# Altium schematic sheet Hbrygga.SchDoc
size A; SheetNumber: 1; SheetTotal: 2
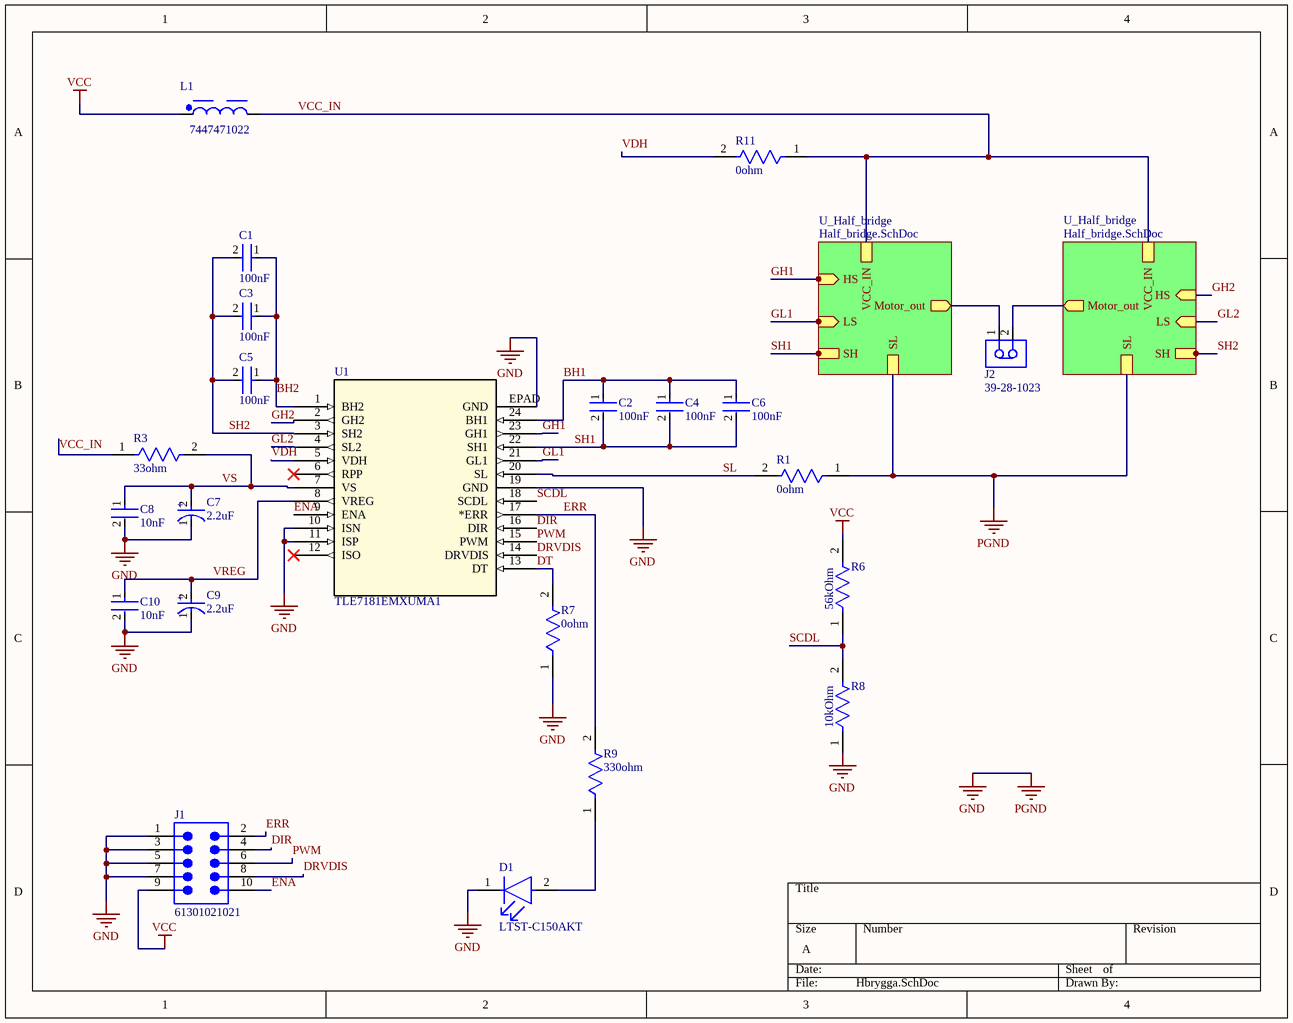
[diagram p0: Hbrygga.SchDoc]

## Parts
C1  100nF  [FP-C1206C-EB-MFG]
C2  100nF  [FP-C1206C-EB-MFG]
C3  100nF  [FP-C1206C-EB-MFG]
C4  100nF  [FP-C1206C-EB-MFG]
C5  100nF  [FP-C1206C-EB-MFG]
C6  100nF  [FP-C1206C-EB-MFG]
C7  2.2uF  [FP-RAD-TH-D_5_0_5-L_11_1-MFG]
C8  10nF  [FP-C0805C-DN-MFG]
C9  2.2uF  [FP-RAD-TH-D_5_0_5-L_11_1-MFG]
C10  10nF  [FP-C0805C-DN-MFG]
D1  LTST-C150AKT  [FP-LTST-C150AKT-MFG]
J1  61301021021  [61301021021]
J2  39-28-1023  [MOLX-39-28-1023-2_V]
L1  7447471022  [WE-TIS_1111]
R1  0ohm  [FP-RC3216-IPC_C]
R3  33ohm  [FP-CR1206-IPC_B]
R6  56kOhm  [FP-MCR10-IPC_C]
R7  0ohm  [FP-RC3216-IPC_C]
R8  10kOhm  [FP-MCR10-IPC_C]
R9  330ohm  [FP-RK73G2B-MFG]
R11  0ohm  [FP-RC3216-IPC_C]
U1  TLE7181EMXUMA1  [PG-SSOP-4_INF]

## Sub-sheets
U_Half_bridge = Half_bridge.SchDoc: HS (in), LS (in), Motor_out (out), VCC_IN, SL, SH
U_Half_bridge = Half_bridge.SchDoc: HS (in), LS (in), Motor_out (out), VCC_IN, SL, SH

## Nets
GND: C7.1(C) C8.2 C9.1(C) C10.2 D1.1(C) J1.1 J1.3 J1.5 J1.7 R1.1 R7.1 R8.1 U1.10(ISN) U1.11(ISP) U1.19(GND) U1.EPAD(GND) ; sheet U_Half_bridge/SL, sheet U_Half_bridge/SL  [also labelled PGND]
VCC: J1.9 L1.1 R6.2
BH1: C2.1 C4.1 C6.1 U1.24(BH1)
BH2: C1.1 C3.1 C5.1 U1.1(BH2)
DIR: J1.4 U1.16(DIR)
DRVDIS: J1.8 U1.14(DRVDIS)
DT: R7.2 U1.13(DT)
ENA: J1.10 U1.9(ENA)
ERR: J1.2 R9.2 U1.17(*ERR)
GH1: U1.23(GH1) ; sheet U_Half_bridge/HS
GH2: U1.2(GH2) ; sheet U_Half_bridge/HS
GL1: U1.21(GL1) ; sheet U_Half_bridge/LS
GL2: U1.4(SL2) ; sheet U_Half_bridge/LS
PWM: J1.6 U1.15(PWM)
SCDL: R6.1 R8.2 U1.18(SCDL)
SH1: C2.2 C4.2 C6.2 U1.22(SH1) ; sheet U_Half_bridge/SH
SH2: C1.2 C3.2 C5.2 U1.3(SH2) ; sheet U_Half_bridge/SH
SL: R1.2 U1.20(SL)
VCC_IN: L1.2 R3.1 R11.1 ; sheet U_Half_bridge/VCC_IN, sheet U_Half_bridge/VCC_IN
VDH: R11.2 U1.5(VDH)
VREG: C9.2(A) C10.1 U1.8(VREG)
VS: C7.2(A) C8.1 R3.2 U1.7(VS)
NetD1_2: D1.2(A) R9.1
NetJ2_1: J2.1 ; sheet U_Half_bridge/Motor_out
NetJ2_2: J2.2 ; sheet U_Half_bridge/Motor_out

Not connected (* = marked no-connect by the designer): U1 6(RPP)* 12(ISO)*

## Notes on the sheet
- (in symbol CMP-05427-000193-1) +

## Library data of the parts
C1-C6 = CMP-03020-008411-1: C1206 0.10 μF U2J 2.00% 16 V; Manufacturer Part Number: C1206C104G4JACAUTO; Manufacturer: KEMET; Material: Ceramic; Temperature Coefficient: 15%; Tolerance: 0.02; Value: 0.10 μF; Automotive Grade: Grade 0; Voltage Rating: 16 V; Lead Free: Yes; RoHS: TRUE; Device Class L3: Ceramic Capacitors; Height: 0.88mm; ComponentLink2Description: Datasheet; Device Class L1: Passive Components; Package: C1206C-EB; Ipc Land Pattern Name: CAPC320160X78; Automotive: Yes; Category: Cap; Octopart: https://octopart.com/c1206c104g4jacauto-kemet-84732513; Temperature Range High: +150°C; Temperature: -55°C to +150°C; ComponentLink2URL: https://content.kemet.com/datasheets/KEM_C1007_X8R_ULTRA_150C_SMD.pdf; Device Class L2: Capacitors; Temperature Characteristic: U2J; Temperature Range Low: -55°C; Capacitance: 0.10 μF
C7 C9 = CMP-05427-000193-1: Aluminum Electrolytic Capacitors (Radial Lead Type) 2.2uF ±20% 100V; Life (Hours): 2000Hour; Leakage Current: 3uA; Voltage: 63V; Dissipation Factor: 0.1%; Lead/Base Style: Straight; Ripple Current: 30mA; Lead Diameter: 0.5mm; Dielectric Material: Aluminium; Packaging: Bulk; Lead Free: Lead Free; Case/Package: Radial; Mount: Through Hole; Diameter: 5mm; Termination: Radial; Radiation Hardening: No; Series: M; Package Quantity: 200; Voltage Rating (DC): 100V; Lead Pitch: 2mm; Tolerance: 20%; Height - Seated (Max): 0.472inch; Min Operating Temperature: -40°C; Max Operating Temperature: 85°C; Number of Pins: 2; RoHS Compliant: Yes; Height: 11mm; Capacitance: 2.2uF; REACH SVHC: No SVHC; Voltage Rating: 100V; Length: 11mm; Contact Plating: Tin; Construction: RADIAL; Ripple Current (AC): 30mA
C8 C10 = CMP-03020-028549-1: C0805 10,000 pF X8R 30ppm/°C 10.00% 50 V; Manufacturer Part Number: C0805C103K5HAC; Manufacturer: KEMET; Material: Ceramic; Voltage Rating: 50 V; Tolerance: 0.1; Temperature Range High: +125°C; ComponentLink2URL: https://content.kemet.com/datasheets/KEM_C1003_C0G_SMD.pdf; Temperature Coefficient: 30ppm/°C; Capacitance: 10,000 pF; Device Class L1: Passive Components; ComponentLink2Description: Datasheet; Package: C0805C-DN; Mouser Description: Multilayer Ceramic Capacitors MLCC - SMD/SMT 50volts 0.01uF 10% ULTRA STABLE X8R; Device Class L3: Ceramic Capacitors; Device Class L2: Capacitors; Height: 0.88mm; Lead Free: Yes; Temperature: -55°C to +125°C; Octopart: https://octopart.com/c0805c103k5hac-kemet-74776188; Temperature Range Low: -55°C; Ipc Land Pattern Name: CAPC200125X78; RoHS: TRUE; Automotive: No; Category: Cap; Value: 10,000 pF; Temperature Characteristic: X8R
D1 = CMP-22017-000004-1: LED AMBER CLEAR SMD; Manufacturer: Lite-On; Luminous Intensity: 6mcd; Viewing Angle: 130°; Wavelength: 602nm; Reverse Voltage: 5V; Forward Current: 30mA; Led Orientation: Top View; Power Dissipation: 100mW; Peak Emmision Wavelength: 610nm; Forward Voltage: 2.1V; ComponentLink2Description: Datasheet; Device Class L3: unset; Height: 1.2mm; RoHS: TRUE; ComponentLink2URL: https://media.digikey.com/pdf/Data%20Sheets/Lite-On%20PDFs/LTST-C150AKT.pdf; Temperature: -55°C to +85°C; Package: 0; Automotive: No; Manufacturer Part Number: LTST-C150AKT; Temperature Range Low: -55°C; Device Class L2: LEDs; Device Class L1: Optoelectronics; Octopart: https://octopart.com/ltst-c150akt-lite-on-549804; Digikey Description: LED AMBER CLEAR SMD; Colour: Amber; Category: Diode; Mouser Description: Standard LEDs - SMD Amber Clear 602nm; Lead Free: Yes; Temperature Range High: +85°C
J1 = CMP-1502-01083-4: THT Angled Pin Header WR-PHD, Pitch 2.54 mm, Dual Row, 10 pins; Row Spacing: 2.54mm; Insulation Resistance: 1GΩ; Insulation: Insulated; Number of Contacts: 10; Current Rating: 3A; Contact Resistance: 20mΩ; Operating Supply Voltage: 250V; Connector Type: Male Pin; Gender: Male; Contact Gender: Male; Contact Mating Length: 5.9944mm; Min Operating Temperature: -40°C; Flammability Rating: UL94 V-0; Contact Material: Copper; Pitch: 2.54mm; Mount: Through Hole; Color: Black; Termination: Through Hole; Number of Rows: 2; Lead Pitch: 2.54mm; Housing Material: PBT; Number of Pins: 10; Packaging: Bulk; Orientation: Right Angle; RoHS: Compliant; Width: 12.7mm; Number of Positions: 10; Max Operating Temperature: 125°C; Contact Plating: Gold; Voltage Rating: 250V; Height: 2.54mm; Length: 12.7mm
J2 = CMP-2000-05244-1: Female Header, Pitch 4.2 mm, 1 x 2 Position, Height 12.8 mm, Tail Length 3.5 mm, -40 to 105 degC, RoHS; Manufacturer: Molex; No. of Poles: 2; Working Voltage: 250V; No. of Rows: 1; Current Rating: 13A; Contact Termination: Solder; No. of Contacts: 4; Connector Body Material: –; Voltage Rating V AC: 600V; Mounting Orientation: Straight; Pitch Spacing: 4.2mm; Connector Mounting: PCB; Connector Type: RectangularPower; Manufacturer URL: http://www.molex.com/; Contact Plating: Tin; Gender: Header; Lead Spacing: 4.2mm; Colour: Clear; Series: Mini-FitJr; No. of Ways: 2; MSL: –; Connector Insert Type: Header; Flammability Rating: UL94V-2; Datasheet URL: https://datasheet.ciiva.com/11746/0900766b80460d9e-11746456.pdf; Termination Method: Solder; Mounting Type: PCBoard; Contact Material: Brass; Datasheet Version: Rev. F, 05/2004; SVHC: –; Connector Mounting Orientation: PCB; Contact Gender: –
L1 = CMP-1406-00024-3: Inductor Power Shielded Wirewound 2.2uH 20% 1KHz Ferrite 8.2A 8.8mOhm DCR RDL Tray; Self Resonant Frequency: 75MHz; Lead Diameter: 650µm; Series Resistance: 7.5mΩ; Inductance: 2.2µH; Saturation Current: 10A; Case/Package: Radial; Length: 11mm; RoHS: Compliant; Features: Shielded; Termination: Radial; Frequency: 75MHz; Max DC Current: 8.2A; Ambient Temperature Range Low: -40°C; Ambient Temperature Range High: 85°C; Min Operating Temperature: -40°C; Mount: Radial, Through Hole; Test Frequency: 1kHz; Core Material: Ferrite; Inductance Tolerance: 20%; Number of Pins: 2; Max Operating Temperature: 125°C; DC Resistance (DCR): 7.5mΩ; Diameter: 11mm; REACH SVHC: Unknown; Lead Pitch: 5mm; Height - Seated (Max): 11.5062mm; Width: 11mm; RMS Current (Irms): 8.2A; Height: 11.5mm; Current Rating: 8.2A; Tolerance: 20%; Composition: Wirewound; Shielding: Shielded
R1 R7 R11 = CMP-13261-001409-1: Res Thick Film 1206 0Ω 5% 0.25W ±300ppm/°C Molded SMD T/R; Max Power Dissipation: 250mW; Voltage Rating (DC): 200V; Resistance: 0mR; Case Code (Imperial): 1206; Number of Terminations: 2; Features: Moisture Resistant; Mount: Surface Mount; Power Rating: 250mW; Max Operating Temperature: 155°C; Tolerance: 5%; Radiation Hardening: No; Length: 3.2mm; Min Operating Temperature: -55°C; Contact Plating: Tin; Lead Free: Lead Free; Case Code (Metric): 3216; Width: 0.063inch; Height: 0.026inch; Military Standard: Not; Packaging: Tape and Reel; Composition: Thick Film; Depth: 1.6mm; Case/Package: 1206
R3 = CMP-07231-004242-1: Thick Film Chip Resistors 1206 33Ω 0.25W 1% 100ppm/°C; Max Power Dissipation: 250mW; Resistance: 33R; Voltage Rating: 200V; Features: Moisture Resistant; Max Operating Temperature: 155°C; Case Code (Imperial): 1206; Composition: Thick Film; Thickness: 610um; Power Rating: 250mW; Military Standard: Not; Tolerance: 1%; Length: 3.2mm; Case/Package: 1206; Mount: Surface Mount; Termination: SMD/SMT; Min Operating Temperature: -55°C; Case Code (Metric): 3216; Package Quantity: 5000; Contact Plating: Tin; Packaging: Tape and Reel; Height: 0.03inch; Radiation Hardening: No; Number of Terminations: 2; Temperature Coefficient: 100ppm/°C; Depth: 1.6mm; Width: 1.6mm
R6 = CMP-08839-017707-1: Thick Film Chip Resistor, 0805, 56kΩ, 5%, 200ppm/°C, 0.125W, 150V; Resistance: 56kR; Max Power Dissipation: 125mW; Series: MCR10; Number of Terminations: 2; Package Quantity: 5000; Length: 0.079inch; Tolerance: 5%; Resistor Type: Thick Film; Width: 0.049inch; Packaging: Tape and Reel; Case Code (Metric): 2012; Voltage Rating (DC): 150V; Case/Package: 0805; RoHS Compliant: Yes; Case Code (Imperial): 0805; Lead Free: Lead Free; Features: Automotive AEC-Q200; Temperature Coefficient: 200ppm/°C; Height: 0.024inch
R8 = CMP-08839-006955-1: Thick Film Chip Resistor, 0805, 10kΩ, 1%, 100ppm/°C, 0.125W, 150V; Max Power Dissipation: 125mW; Resistance: 10kR; Tolerance: 1%; Number of Terminations: 2; Height: 0.024inch; Case/Package: 0805; Series: MCR; Width: 0.049inch; Length: 0.079inch; Resistor Type: Thick Film; Temperature Coefficient: 100ppm/°C; Package Quantity: 10000; Min Operating Temperature: -55°C; Packaging: Tape and Reel; Max Operating Temperature: 155°C
R9 = CMP-04015-101441-1: 330Ω ±0.25% 0.25W Chip Resistor 1206 Thick Film AEC-Q200 Qualified; RoHS Compliant: Yes
U1 = TLE7181EMXUMA1: It incorporates several protection features such as over current and short circuit detection as well as under-, over voltage and over temperature diagnosis. Typical applications are fans, pumps and electric power steering. The MOTIXâ„¢ TLE7181EM is designed for a 12V power net.; Manufacturer_Name: Infineon; Copyright: Copyright (C) 2026 Ultra Librarian. All rights reserved.; Manufacturer_Part_Number: TLE7181EMXUMA1; Datasheet: https://www.infineon.com/dgdl/Infineon-TLE7181EM-DS-v01_01-en.pdf?fileId=db3a30432f5008fe012f5440330e3991; RefDes: RefDes; Type: Type